# EAGLE board driver (EAGLE 9.6.2)
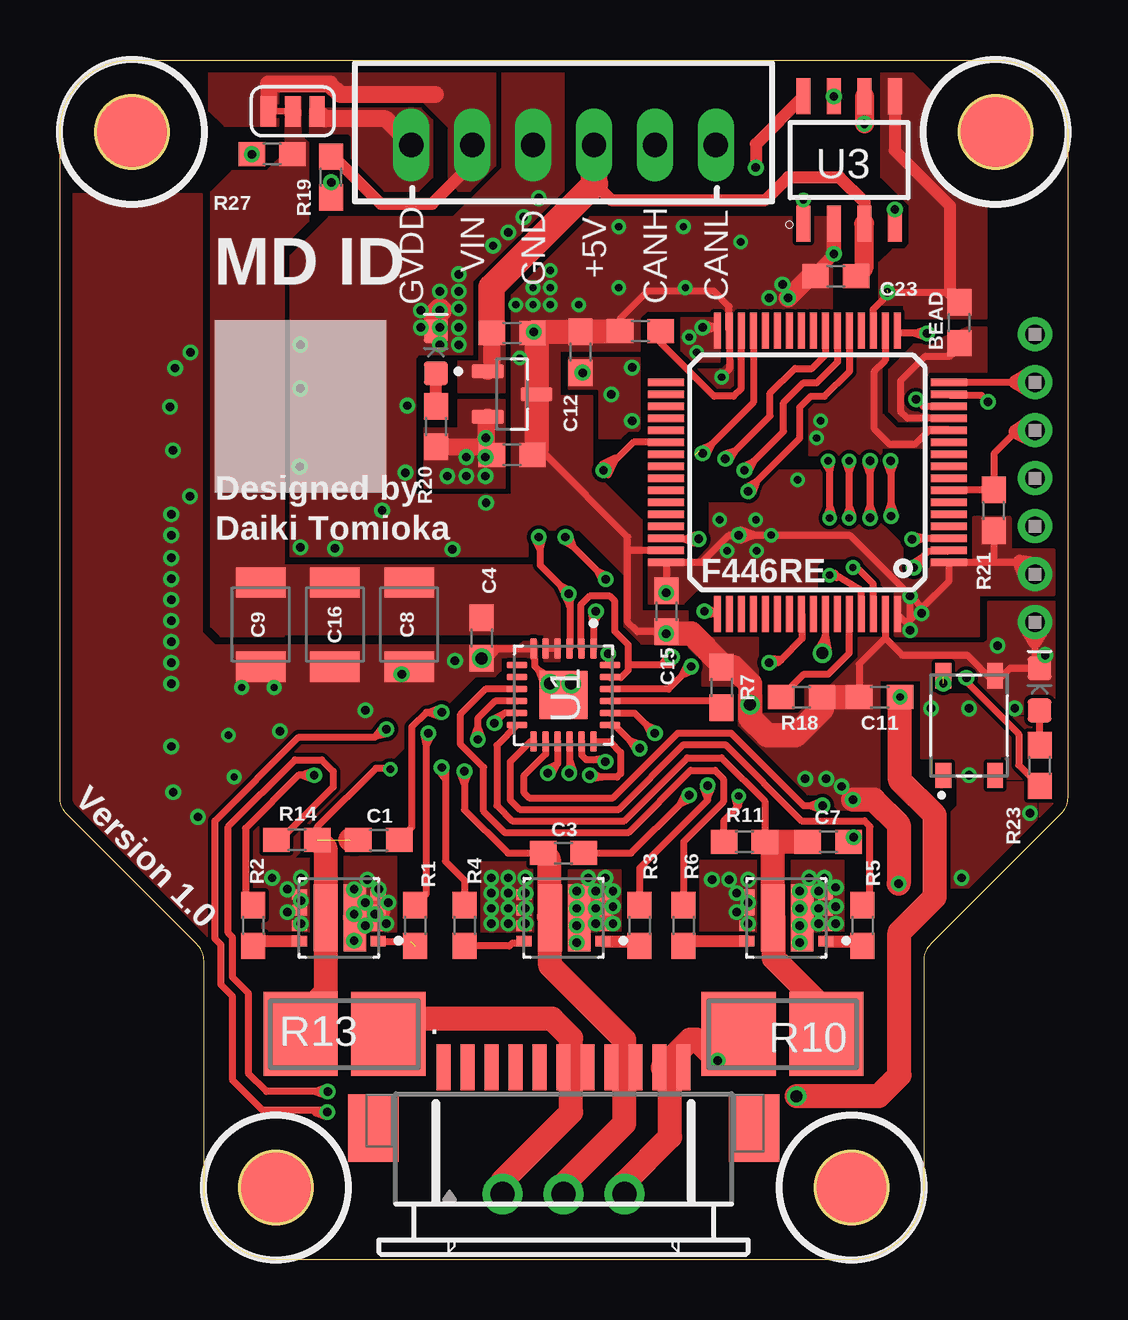
[diagram p1: board, top side]
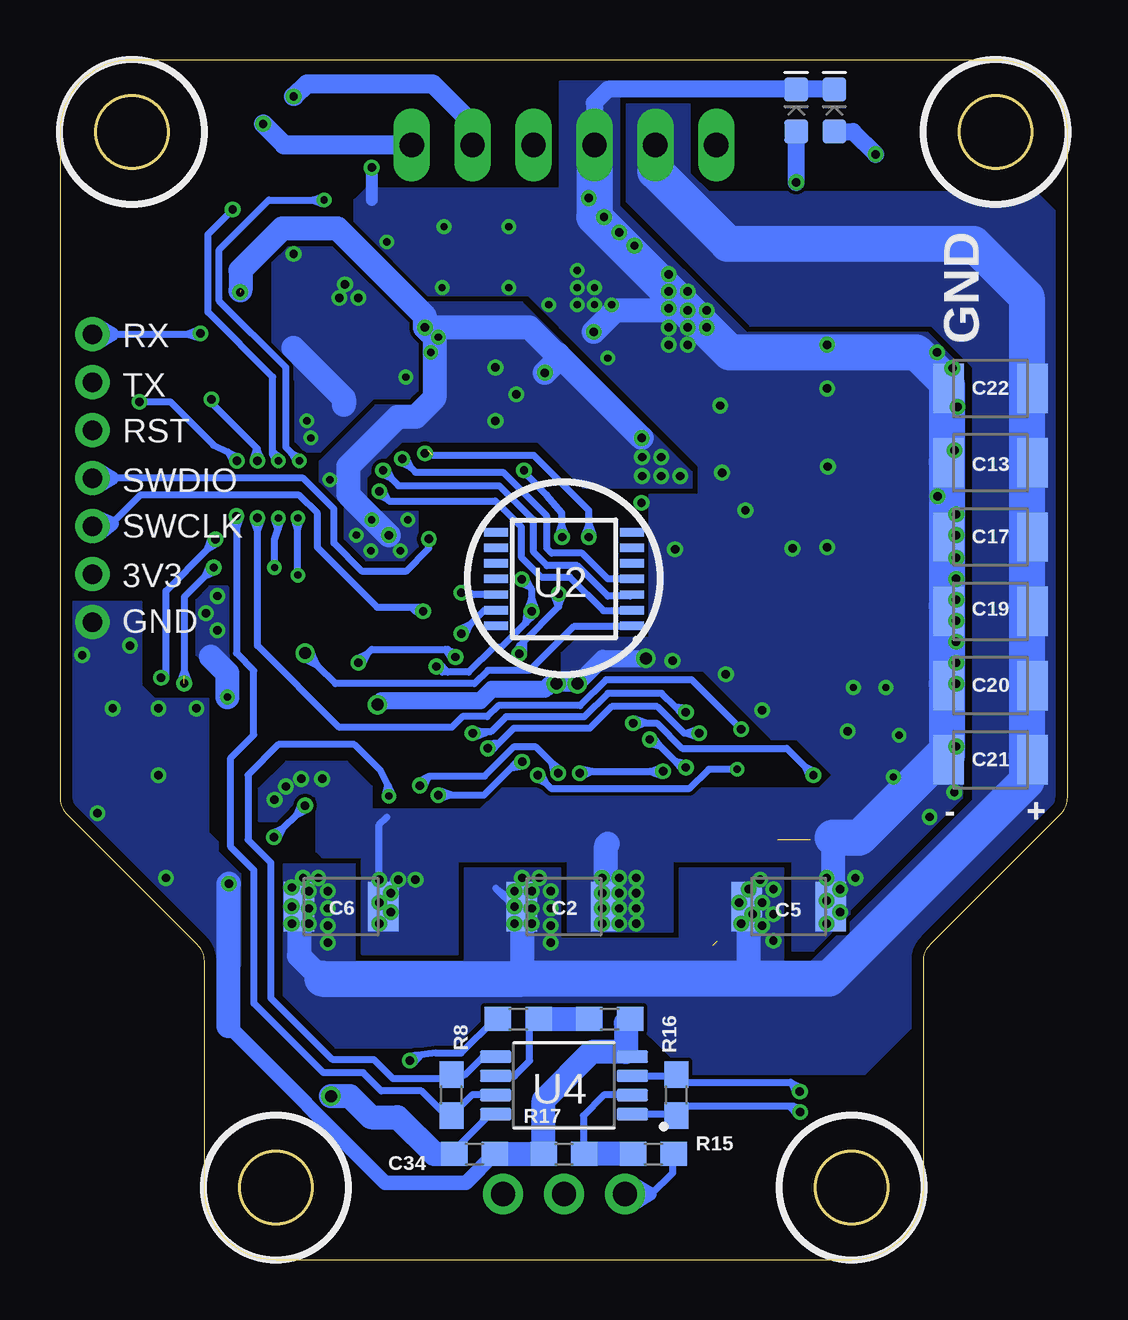
[diagram p2: board, bottom side, seen from below]

Size 42 x 50 mm. Coordinates in mm from the lower left corner, seen from the top.
Outline: 33,0 9,0 arc-90 6,3 6,12.44 arc45 5.71,13.15 0.29,18.56 arc-45 0,19.27 0,47 arc-90 3,50 39,50 arc-90 42,47 42,19.27 arc-45 41.71,18.56 36.29,13.15 arc45 36,12.44 36,3 arc-90 33,0
Outline: circle at 3,47 radius 1.5
Outline: circle at 39,47 radius 1.5
Outline: circle at 9,3 radius 1.5
Outline: circle at 33,3 radius 1.5
Copper layers (1*16): Top 0.035mm / dielectric 1.6mm / Bottom 0.035mm
Design rules "Elecrow_2-layer_PCB_eagle_rule": minimum track width 6mil, minimum drill 12mil, track to track 6mil, track to pad 6mil, pad to pad 6mil, via to via 8mil, smd to smd 0mil, copper to edge 20mil, drill to drill 10mil, minimum pad ring 6mil, minimum via ring 6mil, stop-mask expansion 0mil, vias tented up to drill 100mil, thermal gap 10mil
Net classes: 0 default: width 0.3 mm
tRestrict: area 0,44 to 6,50; area 36,44 to 42,50; area 6,0 to 12,6; area 30,0 to 36,6; 9 lines
bRestrict: area 0,44 to 6,50; area 36,44 to 42,50

## Footprints (pad centres in the part's own frame; a part is rotated, then mirrored left to right if it is on the bottom)
CON-SMT-FFCFPC_52207-1185 = smd 0.6 x 1.9: 1 -5,2.5; 2 -4,2.5; 3 -3,2.5; 4 -2,2.5; 5 -1,2.5; 6 0,2.5; 7 1,2.5; 8 2,2.5; 9 3,2.5; 10 4,2.5; 11 5,2.5 | smd 2.1 x 2.8: P$1 -7.93,-0.03; P$4 7.945,-0.03
0603 = smd 1.1 x 1: 1 -0.85,0; 2 0.85,0
1210 = smd 1.27 x 2.06: 1 -1.755,0; 2 1.755,0
1608 = smd 1.1 x 1: 1 -0.85,0; 2 0.85,0
LED-0603 = smd 1 x 1: A -0.877,0; C 0.877,0
SMT-JUMPER_3_1-NC_TRACE_SILK = smd 0.635 x 1.27: 1 -1.016,0; 2 0,0; 3 1.016,0
1X03-CLEANBIG = drill 1.016 pad 1.676: 1 -2.54,0; 2 0,0; 3 2.54,0
STM32F446RET6 = smd 0.3 x 1.5: BOOT0 -1.75,5.9; PA3 -3.75,-5.9; PA4 -2.25,-5.9; PA5 -1.75,-5.9; PA6 -1.25,-5.9; PA7 -0.75,-5.9; PA14 3.75,5.9; PA15 3.25,5.9; PB0 0.75,-5.9; PB1 1.25,-5.9; PB2 1.75,-5.9; PB3 0.75,5.9; PB4 0.25,5.9; PB5 -0.25,5.9; PB6 -0.75,5.9; PB7 -1.25,5.9; PB8 -2.25,5.9; PB9 -2.75,5.9; PB10 2.25,-5.9; PC4 -0.25,-5.9; PC5 0.25,-5.9; PC10 2.75,5.9; PC11 2.25,5.9; PC12 1.75,5.9; PD2 1.25,5.9; VCAP_1 2.75,-5.9; VDD -2.75,-5.9; VDD1 3.75,-5.9; VDD3 -3.75,5.9; VSS -3.25,-5.9; VSS1 3.25,-5.9; VSS3 -3.25,5.9 | smd 1.5 x 0.3: NRST -5.9,0.75; PA0 -5.9,-2.75; PA1 -5.9,-3.25; PA2 -5.9,-3.75; PA8 5.9,0.25; PA9 5.9,0.75; PA10 5.9,1.25; PA11 5.9,1.75; PA12 5.9,2.25; PA13 5.9,2.75; PB12 5.9,-3.75; PB13 5.9,-3.25; PB14 5.9,-2.75; PB15 5.9,-2.25; PC0 -5.9,0.25; PC1 -5.9,-0.25; PC2 -5.9,-0.75; PC3 -5.9,-1.25; PC6 5.9,-1.75; PC7 5.9,-1.25; PC8 5.9,-0.75; PC9 5.9,-0.25; PC13 -5.9,3.25; PC14 -5.9,2.75; PC15 -5.9,2.25; PH0 -5.9,1.75; PH1 -5.9,1.25; VBAT -5.9,3.75; VDD2 5.9,3.75; VREF+ -5.9,-2.25; VREF- -5.9,-1.75; VSS2 5.9,3.25
TRANS_SIZ240DT-T1-GE3 = smd 0.62 x 0.44: 1 -1.64,0.975; 2 -1.64,0.325; 3 -1.64,-0.325; 4 -1.64,-0.975; 5 1.64,-0.975; 6 1.64,-0.325; 7 1.64,0.325; 8 1.64,0.975 | smd 1.005 x 2.8: 9 0.557,0 | smd 0.935 x 2.8: 10 -0.662,0
SMS-REF = smd 3.1 x 3.5: 1 1.829,0; 2 -1.829,0
R0603 = smd 1.1 x 1: 1 -0.85,0; 2 0.85,0
SOT95P237X112-3N = smd 1.32 x 0.59: 1 -1.015,0.95; 2 -1.015,-0.95; 3 1.015,0
SW_SKRPACE010 = smd 1.05 x 0.65: 1 -2.075,1.075; 2 2.075,1.075; 3 -2.075,-1.075; 4 2.075,-1.075
QFN50P400X400X100-25N = smd 0.27 x 0.86: BSTA 0.75,1.935; DT 0.25,1.935; GHA 1.25,1.935; GLA 0.75,-1.935; GLB 0.25,-1.935; GLC -0.25,-1.935; INHA -0.25,1.935; INHB -0.75,1.935; INHC -1.25,1.935; NC1 -1.25,-1.935; NC2 -0.75,-1.935; SHC 1.25,-1.935 | smd 0.86 x 0.27: BSTB 1.935,0.75; BSTC 1.935,-0.75; GHB 1.935,0.25; GHC 1.935,-1.25; GND -1.935,-1.25; GVDD -1.935,-0.25; INLA -1.935,1.25; INLB -1.935,0.75; INLC -1.935,0.25; MODE -1.935,-0.75; SHA 1.935,1.25; SHB 1.935,-0.25 | smd 2 x 2: PAD 0,0
SOP65P640X120-14N = smd 1 x 0.35: 1 -2.825,1.95; 2 -2.825,1.3; 3 -2.825,0.65; 4 -2.825,0; 5 -2.825,-0.65; 6 -2.825,-1.3; 7 -2.825,-1.95; 8 2.825,-1.95; 9 2.825,-1.3; 10 2.825,-0.65; 11 2.825,0; 12 2.825,0.65; 13 2.825,1.3; 14 2.825,1.95
SOIC127P600X175-8N = smd 1.5 x 0.6: 1 -2.65,1.905; 2 -2.65,0.635; 3 -2.65,-0.635; 4 -2.65,-1.905; 5 2.65,-1.905; 6 2.65,-0.635; 7 2.65,0.635; 8 2.65,1.905
SOP80P620X125-8N = smd 1.31 x 0.52: 1 -2.85,1.2; 2 -2.85,0.4; 3 -2.85,-0.4; 4 -2.85,-1.2; 5 2.85,-1.2; 6 2.85,-0.4; 7 2.85,0.4; 8 2.85,1.2
3MM = smd 3 x 3: P$1 0,0
1X7 = drill 0.8 pad 1.422: 1 -6,0; 2 -4,0; 3 -2,0; 4 0,0; 5 2,0; 6 4,0; 7 6,0
JST-XH-06-PACKAGE-LONG-PAD = drill 1.016 long: 1 -6.35,0; 2 -3.81,0; 3 -1.27,0; 4 1.27,0; 5 3.81,0; 6 6.35,0

## Placement (x,y rotation side)
.  FFC12_11PIN_1MM  [CON-SMT-FFCFPC_52207-1185]  20.99,5.51 0 top
BEAD  0  [0603]  37.49,39.05 90 top
C1  0.1uF  [0603]  13.29,17.49 180 top
C2  22UF-1210  [1210]  20.99,14.72 180 bottom
C3  0.1uF  [0603]  20.99,16.94 180 top
C4  0.1uF  [0603]  17.58,25.91 270 top
C5  22UF-1210  [1210]  11.62,14.72 180 bottom
C6  22UF-1210  [1210]  30.28,14.72 180 bottom
C7  0.1uF  [0603]  32.02,17.41 180 top
C8  22UF-1210  [1210]  14.56,26.46 90 top
C9  22UF-1210  [1210]  8.37,26.46 90 top
C10  0.1UF  [1608]  18.85,33.53 0 top
C11  0.1uF  [0603]  34.17,23.45 180 top
C12  0.1uF  [0603]  21.7,37.81 90 top
C13  22UF-1210  [1210]  3.21,33.21 0 bottom
C14  4.7uF  [0603]  24.2,38.7 180 top
C15  0.1uF  [0603]  25.28,27.02 270 top
C16  22UF-1210  [1210]  11.46,26.46 90 top
C17  22UF-1210  [1210]  3.21,30.11 0 bottom
C18  0.1UF  [1608]  18.85,38.61 0 top
C19  22UF-1210  [1210]  3.21,27.02 0 bottom
C20  22UF-1210  [1210]  3.21,23.92 0 bottom
C21  22UF-1210  [1210]  3.21,20.83 0 bottom
C22  22UF-1210  [1210]  3.21,36.31 0 bottom
C23  0.1uF  [0603]  32.34,40.99 180 top
C34  0.1uF  [0603]  24.72,4.4 0 bottom
D1  WHITE  [LED-0603]  11.31,47.9 90 bottom
D2  RED  [LED-0603]  9.72,47.9 90 bottom
D3  WHITE  [LED-0603]  15.67,37.81 90 top
D6  WHITE  [LED-0603]  40.83,23.77 90 top
JP2  JUMPER-SMT_3_1-NC_TRACE_SILK  [SMT-JUMPER_3_1-NC_TRACE_SILK]  9.71,47.86 180 top
JP3  [1X03-CLEANBIG]  20.99,2.73 0 top
NUCLEO_MAIN  F446RET6  [STM32F446RET6]  31.15,32.81 180 top
Q2  SIZ240DT-T1-GE3  [TRANS_SIZ240DT-T1-GE3]  11.62,14.24 180 top
Q3  SIZ240DT-T1-GE3  [TRANS_SIZ240DT-T1-GE3]  20.99,14.24 180 top
Q4  SIZ240DT-T1-GE3  [TRANS_SIZ240DT-T1-GE3]  30.28,14.24 180 top
R1  50  [0603]  14.8,13.92 270 top
R2  50  [0603]  8.05,13.92 270 top
R3  50  [0603]  24.16,13.92 270 top
R4  50  [0603]  16.86,13.92 270 top
R5  50  [0603]  33.45,13.92 270 top
R6  50  [0603]  25.99,13.92 270 top
R7  50k  [0603]  27.58,23.84 270 top
R8  33k  [0603]  25.67,6.86 90 bottom
R9  33k  [0603]  19.08,10.03 180 bottom
R10  [SMS-REF]  30.12,9.4 180 top
R11  1k  [0603]  28.53,17.41 0 top
R12  1k  [0603]  22.89,10.03 180 bottom
R13  [SMS-REF]  11.86,9.4 0 top
R14  1k  [0603]  9.88,17.49 0 top
R15  1k  [0603]  17.26,4.4 0 bottom
R16  33k  [0603]  16.31,6.86 90 bottom
R17  33k  [0603]  20.99,4.4 0 bottom
R18  10k  [R0603]  30.91,23.45 180 top
R19  10k  [0603]  11.31,45.12 90 top
R20  1k  [R0603]  15.67,34.72 270 top
R21  10k  [R0603]  38.93,31.23 90 top
R23  1k  [0603]  40.83,20.59 270 top
R27  8k  [0603]  8.85,46.07 0 top
REG  AP7333  [SOT95P237X112-3N]  18.85,36.07 0 top
S1  SKRPACE010  [SW_SKRPACE010]  37.9,22.26 90 top
U1  QFN50P400X400X100-25NDRV8300DRGER  [QFN50P400X400X100-25N]  20.99,23.53 270 top
U2  AS5048A-HTSP-500  [SOP65P640X120-14N]  20.99,28.37 180 bottom
U3  MCP2562-E/SN  [SOIC127P600X175-8N]  32.9,45.83 90 top
U4  SOP80P620X125-8N  [SOP80P620X125-8N]  20.99,7.26 180 bottom
U$1  PIN  [3MM]  39,47 0 top
U$2  1X7  [1X7]  40.64,32.57 90 top
U$3  PIN  [3MM]  3,47 0 top
U$4  PIN  [3MM]  9,3 0 top
U$5  PIN  [3MM]  33,3 0 top
X2  JST-XH-06-PIN-LONG-PAD  [JST-XH-06-PACKAGE-LONG-PAD]  20.99,46.47 0 top

## Tracks (layer width: path | path; a pad name or v marks a point on that pad's centre or on a via)
3V3  (via drill 0.3, 0.35, 0.5)  (1 unrouted)
  Top 0.3: 38.93,29.06 NUCLEO_MAIN.VBAT 37.05,28.27 35.93,27.16 | 38.93,29.06 40.02,29.06 40.15,29.06 U$2.2 | R21.1 38.93,29.06 | NUCLEO_MAIN.VDD1 27.4,38.85 27.31,38.85 | 27.31,38.85 v26.78,38.85 | 25.28,28.32 25.28,29.04 NUCLEO_MAIN.VDD2 26.76,29.06 27.9,30.19 27.93,30.19 | 25.28,28.32 C15.1 | 35.4,26.62 35.93,27.16 | v28.29,30.19 28.98,30.19 | 28.98,30.19 v29.64,30.19 32.92,30.19 35.55,27.57 35.93,27.18 35.93,27.16 | 34.9,26.83 NUCLEO_MAIN.VDD3 35.2,26.62 35.4,26.62 | 27.93,30.19 v28.29,30.19 | 21.9,37 C12.1 | 27.31,38.85 26.84,39.01 v26.78,38.85 | 27.31,38.85 26.84,38.68 v26.78,38.85 | 21.83,36.9 21.78,36.91 v21.78,36.96 21.7,36.88 21.7,36.65 21.7,36.64 | 25.28,28.32 25.11,27.85 v25.28,27.79 25.44,27.85 25.28,28.32 | 28.98,30.19 28.37,30.41 v28.29,30.19 | 28.98,30.19 28.37,29.98 v28.29,30.19 | 27.93,30.19 28.25,30.08 v28.29,30.19 | 27.93,30.19 28.25,30.31 v28.29,30.19 | v35.44,27.65 35.44,26.62 35.4,26.62 | NUCLEO_MAIN.VDD 33.9,39.61 34.61,40.32 37.07,40.32
  Top 0.5: U3.5 34.8,46.23 37.1,43.93 37.1,40.29 | 37.07,40.32 37.1,40.29 | 37.1,40.29 BEAD.2
  Top 0.6: 40.02,29.06 40.26,28.42 U$2.2 40.7,28.97 40.02,29.06
  Top 0.7: REG.2 17.75,35.04 v17.75,34.24 17.75,33.77 C10.1 17.66,33.87 R20.2
  Top 1: v30.7,6.81 34.12,6.81 34.99,7.68 34.99,13.64 36.47,15.11 36.47,18.53 35.02,19.98 C11.1
  Bottom 0.3: U4.8 24.07,6.05 25.57,4.56 C34.1 | v26.78,38.85 26.76,38.87 | U2.12 24.76,27.72 | 24.76,27.72 25.2,27.72 v25.28,27.79 | 22.15,37 v21.78,36.96 | v21.78,36.96 21.83,37.13 | v21.78,36.96 21.85,36.8 | 24.76,27.72 25.24,27.62 v25.28,27.79 | 24.76,27.72 25.19,27.95 v25.28,27.79
  Bottom 1: C34.1 26.39,4.4 27.93,5.94 29.04,5.94 29.91,6.81 v30.7,6.81 | v17.75,34.24 21.24,37.73 21.24,37.65 | 21.24,37.65 22.44,38.85 v26.78,38.85 | v26.78,38.85 26.78,39.32 30.44,42.97 32.74,42.97 34.48,41.24 34.48,40.4 | v26.78,38.85 26.39,38.45 26.39,35.91 27.17,35.12 27.92,35.12 29.99,33.06 29.99,31.89 v28.29,30.19 | v21.78,36.96 21.24,37.51 21.24,37.65 | C11.1 35.02,24.43 35.7,25.12
  other vias: 35.02,23.45 35.44,26.23 35.91,26.94 26.23,38.45 26.55,37.81 27.5,30.83 29.01,30.83 17.74,33.45 17.74,32.66 16.94,32.66 16.15,32.66 16.94,33.45 27.82,29.54 29.04,29.54 30.75,32.5 23.85,34.96 23.85,37.18 22.97,36.07 34.49,40.32
  pour Top (no thermals): 34.8,27.65 35.12,27.65 36.15,28.69 36.31,28.84 36.31,29.16 38.29,29.16 38.29,25.99 34.8,25.99
  pour Bottom (no thermals): 35.04,28.05 35.75,28.05 36.31,27.5 36.31,25.27 36.31,25.19 35.59,24.48 35.04,24.48 34.96,24.56 34.96,27.97
  pour Top (no thermals): 25.91,39.24 27.5,39.24 27.5,37.42 26.39,37.42 25.91,37.89
  pour Top (no thermals): 24.56,29.16 24.56,27.34 25.99,27.34 26.7,28.05 31.55,28.05 31.55,28.92 31.86,29.24 33.21,29.24 34.25,28.21 34.25,28.13 34.4,27.97 34.72,27.97 34.8,27.89 34.8,27.1 36.23,27.1 36.23,28.37 35.36,28.37 35.12,28.61 35.12,29.8 32.02,32.89 27.1,32.89 27.1,29.72 26.55,29.16
  pour Bottom (no thermals): 15.67,32.81 15.67,32.18 20.2,32.18 22.1,34.08 27.74,34.08 29.24,32.58 29.24,31.78 28.61,31.15 27.1,31.15 27.1,29.72 27.66,29.16 29.24,29.16 30.12,30.04 30.12,31.38 31.15,32.42 31.15,33.29 28.85,35.59 27.02,35.59 26.78,35.83 26.78,39.88 22.74,39.88
  pour Top (no thermals): 16.62,35.83 18.53,35.83 18.53,32.18 15.2,32.18 15.2,34.64 16.62,34.64
  pour Top (no thermals): 41.39,29.56 41.39,27.73 38.13,27.73 38.13,30.91 39.56,30.91 39.56,29.56
  pour Top (no thermals): 24.16,37.58 21.23,37.58 21.23,36.31 22.42,36.31 22.5,36.23 22.5,34.24 23.37,34.24 23.69,34.56 24.09,34.56 24.16,34.64
  pour Top (no thermals): 35.52,49.48 34.25,49.48 34.25,45.12 35.44,43.93 35.44,42.34 35.2,42.1 34.72,42.1 34.17,41.55 34.17,39.8 35.2,39.8 35.2,39.24 38.61,39.24 38.61,46.39
5V
  Top 0.5: 22.26,44.88 22.3,44.84 22.97,44.16 29.4,44.16 30.36,45.12 32.5,45.12 33.53,44.09 U3.3
  Top 0.7: C18.1 18,37.18 REG.1
  Top 0.8: C23.1 33.51,41.31 33.51,43.16 U3.3
  Top 1.1: C18.1 18,40.54 22.3,44.84 | 22.26,44.88 X2.4
  pour Top (no thermals): 17.5,38.29 18.53,38.29 18.53,36.15 16.62,36.15 16.62,37.42 17.5,37.42
BOOT0
  Top 0.3: R18.2 31.01,24.4 32.02,24.4 32.9,25.28 NUCLEO_MAIN.BOOT0
BSTA  (via drill 0.35)
  Top 0.3: U1.BSTA 23.96,22.78 24.43,22.3 | v24.8,21.93 24.43,22.3 | v15.91,22.81 15.38,22.81 | 15.38,22.81 15.28,22.81 14.66,22.2 14.66,18.02 C1.1 | 24.43,22.3 24.64,21.86 v24.8,21.93 | 24.43,22.3 24.88,22.09 v24.8,21.93 | 15.38,22.81 15.85,22.65 v15.91,22.81 | 15.38,22.81 15.85,22.98 v15.91,22.81
  Bottom 0.3: v15.91,22.81 16.13,22.81 16.38,23.06 | 16.38,23.06 16.92,23.6 19.16,23.6 20.15,22.62 23.41,22.62 24.01,22.02 24.5,22.02 | 24.27,21.94 24.64,21.94 24.64,21.93 v24.8,21.93 | 24.27,21.94 24.74,21.77 v24.8,21.93 | 24.27,21.94 24.5,22.02 | 24.5,22.02 24.74,22.1 v24.8,21.93 | 16.38,23.06 15.88,22.99 v15.91,22.81 | 16.38,23.06 16.04,22.69 v15.91,22.81
BSTB  (via drill 0.35)
  Top 0.3: U1.BSTB 21.74,21.03 21.94,20.83 22.22,20.83 | v22.74,20.75 22.66,20.83 22.22,20.83 | C3.1 23.81,16.94 25.86,18.99 | v26.23,19.36 25.86,18.99 | 22.38,20.86 22.7,20.69 v22.74,20.75 | 22.22,20.83 22.38,20.86 | 22.38,20.86 22.7,20.92 v22.74,20.75 | 25.86,18.99 26.3,19.2 v26.23,19.36 | 25.86,18.99 26.07,19.43 v26.23,19.36
  Bottom 0.3: v22.74,20.75 22.93,20.75 23.19,20.49 | v26.23,19.36 25.7,19.36 | 25.7,19.36 24.32,19.36 23.19,20.49 | 23.19,20.49 22.87,20.86 v22.74,20.75 | 23.19,20.49 22.71,20.57 v22.74,20.75 | 25.7,19.36 26.17,19.19 v26.23,19.36 | 25.7,19.36 26.17,19.53 v26.23,19.36
BSTC  (via drill 0.35)
  Top 0.3: U1.BSTC 20.24,21.07 19.32,20.15 19.32,19.48 19.56,19.24 23.05,19.24 25.75,21.94 27.97,21.94 30.99,18.92 31.26,18.92 | 31.26,18.92 v31.78,18.92 | C7.1 32.9,17.48 v33.08,17.61 | 31.26,18.92 31.73,18.76 v31.78,18.92 | 31.26,18.92 31.73,19.09 v31.78,18.92
  Bottom 0.3: 32.14,18.54 31.88,18.8 31.88,18.82 v31.78,18.92 | 32.14,18.54 32.71,17.98 | 32.71,17.98 v33.08,17.61 | 32.14,18.54 31.95,18.99 v31.78,18.92 | 32.14,18.54 31.7,18.77 v31.78,18.92 | 32.71,17.98 32.92,17.53 v33.08,17.61 | 32.71,17.98 33.16,17.77 v33.08,17.61
C_U  (via drill 0.35)
  Top 0.3: v11.15,6.14 10.62,6.14 | 10.84,6.22 8.45,6.22 7.18,7.49 7.18,10.99 6.7,11.46 6.7,13.13 6.46,13.37 6.46,18.29 9.96,21.78 13.12,21.78 13.17,21.82 | v33.77,33.29 33.77,32.77 | 33.77,32.77 33.77,31.43 | 33.77,31.43 v33.77,30.91 | v13.61,22.11 13.45,22.11 13.17,21.82 | 10.62,6.14 11.09,5.98 v11.15,6.14 | 10.62,6.14 10.84,6.22 | 10.84,6.22 11.09,6.31 v11.15,6.14 | 13.17,21.82 13.65,21.93 v13.61,22.11 | 13.17,21.82 13.47,22.21 v13.61,22.11 | 33.77,31.43 33.6,30.97 v33.77,30.91 | 33.77,31.43 33.94,30.97 v33.77,30.91 | 33.77,32.77 33.94,33.23 v33.77,33.29 | 33.77,32.77 33.6,33.23 v33.77,33.29 | v35.68,35.85 35.7,35.85 35.98,35.56 NUCLEO_MAIN.PA0
  Bottom 0.3: U4.1 16.35,6.05 R16.1 15.91,6.41 11.6,6.41 | 11.6,6.41 11.41,6.41 v11.15,6.14 | v13.61,22.11 15.67,24.16 19.24,24.16 20.31,23.09 23.73,23.09 24.19,22.63 25.22,22.63 25.67,22.18 30.36,22.18 33.77,25.59 33.77,30.38 | 33.77,30.38 v33.77,30.91 | v33.77,33.29 33.77,33.79 33.8,33.81 | 11.6,6.41 11.12,6.32 v11.15,6.14 | 11.6,6.41 11.28,6.03 v11.15,6.14 | 33.77,30.38 33.94,30.85 v33.77,30.91 | 33.77,30.38 33.6,30.85 v33.77,30.91 | 33.8,33.81 33.61,33.36 v33.77,33.29 | 33.8,33.81 33.94,33.34 v33.77,33.29 | v35.68,35.85 35.68,35.7 33.8,33.81
C_W  (via drill 0.35)
  Top 0.3: v34.64,30.99 34.63,31 34.63,31.51 | v34.63,33.29 34.63,32.77 | 34.63,32.77 34.63,31.51 | 34.63,32.77 34.79,33.23 v34.63,33.29 | 34.63,32.77 34.46,33.23 v34.63,33.29 | 34.63,31.51 34.47,31.04 v34.64,30.99 | 34.63,31.51 34.81,31.05 v34.64,30.99 | NUCLEO_MAIN.PA1 37.1,36.02 38.42,36.02 v38.69,35.75
  Bottom 0.3: U4.7 24.83,6.86 R8.1 25.91,6.01 26.93,7.03 28.61,7.03 29.36,7.78 31.02,7.78 33.91,10.67 33.91,16.22 34.88,17.2 34.88,20.91 33.92,21.87 33.92,24.55 34.64,25.27 34.64,30.46 | 35,33.66 v34.63,33.29 | v34.64,30.99 34.64,30.46 | 35,33.66 35.6,33.95 37.41,35.75 v38.69,35.75 | 35,33.66 34.55,33.45 v34.63,33.29 | 35,33.66 34.79,33.21 v34.63,33.29 | 34.64,30.46 34.81,30.93 v34.64,30.99 | 34.64,30.46 34.48,30.93 v34.64,30.99
CANH  (via drill 0.35)
  Bottom 0.8: U3.7 32.23,48.48 31.71,49.01 26.47,49.01 24.8,47.34 X2.5
  other vias: 32.26,48.48
CANL  (via drill 0.35)
  Top 0.8: U3.6 v33.53,47.34
  Bottom 0.8: v33.53,47.34 32.66,46.47 X2.6
CANRX  (via drill 0.3, 0.35)
  Top 0.3: NUCLEO_MAIN.PB9 33.9,28.16 33.21,28.84 v33.05,28.84 | v32.9,30.91 32.9,31.37 | 32.9,31.37 32.9,32.83 | 32.9,32.83 v32.9,33.29 | 32.9,31.37 32.75,30.96 v32.9,30.91 | 32.9,31.37 33.04,30.96 v32.9,30.91 | 32.9,32.83 33.04,33.24 v32.9,33.29 | 32.9,32.83 32.75,33.24 v32.9,33.29 | v34.8,43.77 U3.4
  Bottom 0.3: v33.05,28.84 33.05,30.01 32.9,30.45 | 32.9,30.45 v32.9,30.91 | v32.9,33.29 33.13,33.53 33.13,33.68 | 33.13,33.68 33.13,36.78 35.83,39.48 35.83,42.74 v34.8,43.77 | 32.9,30.45 33.04,30.86 v32.9,30.91 | 32.9,30.45 32.75,30.86 v32.9,30.91 | 33.13,33.68 32.8,33.41 v32.9,33.29 | 33.13,33.68 33.05,33.26 v32.9,33.29
CANTX  (via drill 0.3)
  Top 0.3: NUCLEO_MAIN.PB8 33.4,27.86 33.31,27.96 32.34,28.53 32.18,28.53 | v32.08,28.53 32.26,28.53 32.38,28.41 | v32.08,30.91 32.08,31.37 | 32.08,31.37 32.08,32.84 | 32.08,32.84 32.08,33.23 v32.02,33.29 | v30.99,44.16 30.99,43.71 | 30.99,43.71 U3.1 | 32.38,28.41 32.3,28.61 v32.08,28.53 | 32.38,28.41 32.18,28.53 | 32.18,28.53 32.11,28.57 v32.08,28.53 | 32.08,31.37 31.94,30.96 v32.08,30.91 | 32.08,31.37 32.23,30.96 v32.08,30.91 | 32.08,32.84 32.17,33.26 v32.02,33.29 | 32.08,32.84 31.89,33.22 v32.02,33.29 | 30.99,43.71 31.14,44.11 v30.99,44.16 | 30.99,43.71 30.85,44.11 v30.99,44.16
  Bottom 0.3: v32.08,28.53 32.08,30.45 | 32.08,30.45 v32.08,30.91 | v32.02,33.29 32.35,33.61 | 32.35,33.61 32.58,33.85 32.58,37.18 35.36,39.96 35.36,42.1 33.29,44.16 31.45,44.16 | 31.45,44.16 v30.99,44.16 | 32.08,30.45 32.23,30.86 v32.08,30.91 | 32.08,30.45 31.94,30.86 v32.08,30.91 | 32.35,33.61 31.96,33.43 v32.02,33.29 | 32.35,33.61 32.16,33.22 v32.02,33.29 | 31.45,44.16 31.04,44.31 v30.99,44.16 | 31.45,44.16 31.04,44.02 v30.99,44.16
CLK  (via drill 0.35)
  Top 0.3: v28.69,32.02 28.69,32.08 29.03,32.42 | 29.03,32.42 30.84,34.23 30.84,35.52 31.3,35.98 31.87,35.98 32.9,37.01 NUCLEO_MAIN.PA5 | 29.03,32.42 28.6,32.17 v28.69,32.02 | 29.03,32.42 28.86,31.96 v28.69,32.02
  Bottom 0.3: U2.2 18.19,27.04 19.35,27.04 20.76,28.45 21.94,28.45 22.78,29.28 22.78,30.55 23.85,31.62 28.29,31.62 28.32,31.65 | v28.69,32.02 28.32,31.65 | 28.32,31.65 28.76,31.86 v28.69,32.02 | 28.32,31.65 28.53,32.1 v28.69,32.02
CS  (via drill 0.5)
  Top 0.3: NUCLEO_MAIN.PB6 31.9,26.01 | 31.9,26.01 31.9,25.39 v31.78,25.27 | 31.9,26.01 31.56,25.39 v31.78,25.27 | 31.9,26.01 32.03,25.32 v31.78,25.27
  Bottom 0.3: U2.1 18.2,26.38 20.59,26.38 22.42,24.56 24.16,24.56 24.72,24 30.51,24 31.25,24.74 | 31.25,24.74 v31.78,25.27 | 31.25,24.74 31.89,25.05 v31.78,25.27 | 31.25,24.74 31.56,25.38 v31.78,25.27
DT
  Top 0.3: R7.2 27.3,23.28 U1.DT
GHA  (via drill 0.35)
  Top 0.3: R1.1 15.28,15.25 15.28,21.42 | v15.35,21.94 15.28,21.86 15.28,21.42 | v24.16,21.3 24.09,21.3 23.76,21.63 | 23.76,21.63 23.11,22.28 U1.GHA | 15.28,21.42 15.51,21.86 v15.35,21.94 | 15.28,21.42 15.18,21.91 v15.35,21.94 | 23.76,21.63 24.01,21.21 v24.16,21.3 | 23.76,21.63 24.22,21.47 v24.16,21.3
  Bottom 0.3: v24.16,21.3 23.93,21.3 23.69,21.54 | 23.69,21.54 23.09,22.14 19.92,22.14 19.01,23.05 17.1,23.05 15.99,21.94 15.88,21.94 | 15.88,21.94 v15.35,21.94 | 15.88,21.94 15.41,22.11 v15.35,21.94 | 15.88,21.94 15.41,21.77 v15.35,21.94 | 23.69,21.54 24.04,21.18 v24.16,21.3 | 23.69,21.54 24.18,21.48 v24.16,21.3
GHB  (via drill 0.35)
  Top 0.3: U1.GHB 21.24,20.8 | 21.24,20.8 21.24,20.28 v21.23,20.27 | v27,19.76 27,19.23 | 27,19.23 27,19.14 24.16,16.31 R3.1 | 21.28,20.69 21.13,20.31 v21.23,20.27 | 21.24,20.8 21.28,20.69 | 21.28,20.69 21.4,20.33 v21.23,20.27 | 27,19.23 27.17,19.7 v27,19.76 | 27,19.23 26.83,19.7 v27,19.76
  Bottom 0.3: v21.23,20.27 21.23,20.43 21.51,20.71 | 21.51,20.71 22.18,21.38 23.07,21.38 24.3,20.15 26.6,20.15 26.63,20.13 | v27,19.76 26.63,20.13 | 21.51,20.71 21.12,20.41 v21.23,20.27 | 21.51,20.71 21.4,20.23 v21.23,20.27 | 26.63,20.13 26.84,19.68 v27,19.76 | 26.63,20.13 27.08,19.92 v27,19.76
GHC
  Top 0.3: U1.GHC 19.61,21.59 18.77,20.75 18.77,19.16 19.16,18.76 23.29,18.76 25.99,21.46 27.74,21.46 30.91,18.29 33.53,18.29 33.77,18.05 33.77,14.77 R5.1
GLA  (via drill 0.35)
  Top 0.3: U1.GLA 18.53,22.78 18.48,22.73 | 18.48,22.73 v18.11,22.36 | v10.59,20.19 10.07,20.19 | 10.07,20.19 9.96,20.19 7.73,17.97 7.73,15.09 R2.1 | 18.48,22.73 18.33,22.66 | 18.33,22.66 18.04,22.52 v18.11,22.36 | 18.33,22.66 18.17,22.33 v18.11,22.36 | 10.07,20.19 10.53,20.03 v10.59,20.19 | 10.07,20.19 10.53,20.36 v10.59,20.19
  Bottom 0.3: v18.11,22.36 17.58,22.36 | 17.58,22.36 17.12,22.36 16.07,21.3 11.7,21.3 10.96,20.56 | v10.59,20.19 10.96,20.56 | 17.58,22.36 18.05,22.19 v18.11,22.36 | 17.58,22.36 18.05,22.52 v18.11,22.36 | 10.96,20.56 10.52,20.35 v10.59,20.19 | 10.96,20.56 10.75,20.12 v10.59,20.19
GLB  (via drill 0.35)
  Top 0.3: U1.GLB 18.14,23.28 17.41,22.55 17.41,22.2 | 17.41,22.2 v17.41,21.68 | v15.91,20.51 16.07,20.35 16.07,20.01 | 16.07,20.01 16.07,16.6 16.86,15.81 R4.1 | 17.41,22.2 17.25,21.74 v17.41,21.68 | 17.41,22.2 17.58,21.74 v17.41,21.68 | 16.07,20.01 16.09,20.5 v15.91,20.51 | 16.07,20.01 15.77,20.4 v15.91,20.51
  Bottom 0.3: v15.91,20.51 16.09,20.51 16.36,20.78 | v17.41,21.68 17.25,21.68 16.97,21.39 | 16.97,21.39 16.36,20.78 | 16.97,21.39 17.45,21.51 v17.41,21.68 | 16.97,21.39 17.27,21.79 v17.41,21.68 | 16.36,20.78 15.88,20.68 v15.91,20.51 | 16.36,20.78 16.05,20.4 v15.91,20.51
GLC
  Top 0.3: U1.GLC 17.75,23.78 16.7,22.73 16.7,21.46 17.66,20.51 17.66,18.68 18.53,17.81 23.71,17.81 26.29,20.39 27.31,20.39 27.65,20.04 27.65,19.08 25.99,17.41 R6.1
GND  (via drill 0.3, 0.35, 0.5)
  Top 0.3: 19.95,24.57 19.79,24.73 19.79,25.02 19.74,25.07 U1.GND 18.21,25.46 | 19.95,24.57 20.56,23.96 | 20.56,23.96 U1.PAD 21.07,23.61 | C4.2 17.98,25.46 18.21,25.46 | NUCLEO_MAIN.VSS 34.4,37.47 33.96,37.03 33.96,34.61 34.59,33.98 35.63,33.98 36.25,34.6 37.02,34.6 NUCLEO_MAIN.VREF- | U$2.1 40.64,25.77 40.64,24.83 D6.C 39.6,24.64 38.98,24.03 38.83,24.19 | 38.83,24.19 S1.4 | NUCLEO_MAIN.VSS3 34.4,25.91 | 34.4,25.91 34.4,25.9 33.32,24.82 C11.2 | 34.4,25.91 35.11,25.19 37.82,25.19 38.83,24.19 | v19.75,38.66 C18.2 | 19.86,36.15 REG.3 | C14.2 23.35,39.22 24.48,40.35 27.26,40.35 27.9,39.72 NUCLEO_MAIN.VSS1 27.9,37.1 v27.58,36.78 | C10.2 20.25,33.53 23.66,30.12 23.66,29.56 | 23.66,29.56 NUCLEO_MAIN.VSS2 | C15.2 24.76,26.17 | 24.76,26.17 24.06,26.17 23.66,26.57 23.66,29.56 | 21.07,23.61 21.31,23.84 v21.31,24 | U3.2 32.4,43.25 32.26,43.25 | 24.76,26.17 25.19,25.93 v25.28,26.09 25.24,26.26 24.76,26.17 | 20.56,23.96 21.24,23.76 v21.31,24 | 20.56,23.96 21.21,24.23 v21.31,24 | 19.95,24.57 20.2,23.91 v20.43,24 | 19.95,24.57 20.56,24.22 v20.43,24 | 21.07,23.61 20.63,24.16 v20.43,24 | 21.07,23.61 20.38,23.76 v20.43,24 | 18.21,25.46 17.52,25.3 C4.2 | 18.21,25.46 17.78,24.9 C4.2
  Top 0.5: 32.26,43.25 U3.2 | U3.8 29.01,46.5 v29.01,45.51 | v32.26,41.91 31.49,41.14 C23.2
  Top 0.6: v32.26,41.91 32.26,43.11 | 40.64,25.77 41,26.36 U$2.1 40.29,26.36 40.64,25.77
  Top 0.8: C23.2 31.26,40.99 v30.36,40.09
  Top 1: D3.C 15.67,39.4 v15.83,39.56 | v19.75,38.66 C12.2 21.74,38.7 C14.2 | C18.2 19.86,38.44 19.86,36.15 | REG.3 19.86,33.69 C10.2 | v34.96,15.67 34.96,18.13 33.93,19.16 v33.05,19.16 | C15.2 25.35,26.09 26.32,26.09 27.58,24.83 R7.1 28.08,24.69 28.77,24 v28.77,23.13 28.77,22.57 29.48,21.86 30.67,21.86 31.76,22.95 R18.1 C11.2
  Bottom 0.3: R9.1 18.23,8.55 U4.4 | U2.13 24.3,27.07 24.9,26.46 | 24.9,26.46 v25.28,26.09 | v9.48,15.43 9.64,15.55 9.69,15.35 | 9.69,15.35 9.79,15 | 9.79,15 9.82,14.88 | 9.82,14.88 C5.1 | v28.21,15.27 28.19,15.41 28.47,14.82 | 28.47,14.82 C6.1 | C21.1 4.9,21 5.04,20.91 | C20.1 4.9,24 4.99,24 | 4.99,24 5.04,24 | 4.95,27.07 4.9,27.25 5.04,27.25 | 4.95,27.07 C19.1 | C13.1 4.9,33.25 5.04,33.25 | C22.1 4.9,36.5 5.04,36.5 | 9.79,15 9.65,15.48 v9.48,15.43 | 9.79,15 9.38,15.28 v9.48,15.43 | 9.69,15.35 9.87,14.89 v10.04,14.95 10.12,15.11 9.69,15.35 | 9.82,14.88 9.39,14.63 v9.48,14.48 9.65,14.41 9.82,14.88 | 28.47,14.82 28.39,15.3 v28.21,15.27 | 28.47,14.82 28.1,15.14 v28.21,15.27 | 4.95,27.07 4.81,27.55 v4.64,27.5 4.54,27.35 4.95,27.07 | 24.9,26.46 25.12,26.01 v25.28,26.09 | 24.9,26.46 25.35,26.25 v25.28,26.09 | 4.99,24 5.45,23.84 5.51,24 5.45,24.17 4.99,24 | v27.9,15.83 28.07,15.87 28.2,15.4 27.79,15.68 v27.9,15.83 | v27.9,15.83 28.07,15.88 28.2,15.4 27.79,15.68 v27.9,15.83 | v28.69,15.83 28.69,18.13 28.37,18.45 | 28.29,15.21 28.54,14.79 v28.69,14.88 28.75,15.04 28.29,15.21 | 28.4,14.97 28.08,14.59 v28.21,14.48 28.39,14.47 28.4,14.97 | 4.96,27.04 4.54,26.77 v4.64,26.62 4.81,26.57 4.96,27.04
  Bottom 0.5: v29.01,45.51 29.01,44.16
  Bottom 0.6: 34.98,9.74 28.45,3.21 25.07,3.21 23.88,4.4 C34.2
  Bottom 0.7: D2.C D1.C 19.16,48.77 19.72,48.21 X2.3 | v28.77,23.13 28.61,23.29 24.48,23.29 24.01,23.77 21.78,23.77 21.55,24 v21.31,24 v20.43,24 19.38,25.06 C4.2
  Bottom 1: C34.2 R17.1 21.84,6.64 19.84,8.65 18.41,8.65 18.41,9.85 R9.1 | v15.83,39.56 18.86,39.56 v19.75,38.66 | v34.96,15.67 34.98,15.65 34.98,9.74 | C2.1 19.23,17.27 19.16,17.34 | 9.79,17.57 9.79,14.8 C5.1 | 30.16,35.63 30.16,35.89 32.26,38
  Bottom 1.5: X2.3 19.72,43.45 v15.83,39.56 14.08,37.81 6.31,37.81 5.04,36.54 5.04,36.5 5.04,33.25 5.04,27.25 5.04,24 5.04,21.23 | 5.04,21.23 5.04,20.91 | 5.04,21.23 8.69,17.57 9.79,17.57
  other vias: 10.04,14 28.69,14 18.69,15.27 19.4,14.64 18.69,14.64 19.4,14 4.58,35.54 4.64,29.24 4.64,28.37 17.58,25.06 31.71,34.96 4.64,25.75 4.64,24.88 4.64,31.07 4.64,24 4.64,30.19 8.85,15.91 10.04,15.91 17.97,15.91 18.69,15.91 19.4,15.27 27.18,15.83 17.97,15.27 17.97,14.64 17.97,14 18.69,14 19.4,15.91 20.43,39.8 19.72,39.8 19.01,39.8 20.43,40.51 19.72,40.51 20.43,41.23 19.16,37.58 30.12,40.64 29.56,40.09 31.55,34.24 8.93,23.84 7.58,23.84 7.26,20.11 31.07,20.03 31.94,20.03 32.58,19.72 15.83,40.35 16.62,40.35 16.62,39.64 16.62,38.85 15.83,38.85 15.04,39.56 15.04,38.85 16.62,41.07 18.05,42.26 18.69,42.81 19.32,43.45 19.96,44.24 15.83,38.13 16.62,38.13 23.29,43.05 25.99,43.05 28.37,42.42 26.07,40.51 23.29,40.51 21.62,39.8 10.02,38.13 9.99,33.05 10.02,29.69 11.46,29.64 13.43,31.23 14.4,32.8 14.48,35.59 10.02,36.31 12.74,22.89 14.24,24.4 16.47,24.96 16.36,29.61 17.76,31.54 4.8,37.16 5.43,37.81 4.72,19.48 4.64,21.38 5.75,18.45 9.16,22.02 7.02,21.86 41.07,25.19 39.8,22.97 36.31,22.97 37.9,22.97 37.9,20.19 40.44,18.61 37.58,15.91 39.09,25.59 4.71,33.73 5.41,31.82
  pour Top (no thermals): 8.45,16.7 10.43,16.7 10.43,13.68 8.45,13.68
  pour Top (no thermals): 17.58,16.54 19.8,16.54 19.8,13.68 17.58,13.68
  pour Top (no thermals): 26.7,16.62 29.09,16.62 29.09,13.68 26.7,13.68
  pour Top (no thermals): 19.32,25.75 19.88,25.75 19.88,25.11 18.37,25.11 18.37,24.56 18.13,24.32 17.34,24.32 5.75,12.73 -1.97,12.73 -1.97,44.4 5.91,44.4 5.91,26.15 6.46,25.59 19.16,25.59
  pour Bottom (no thermals): 18.69,49.09 18.69,43.93 13.37,38.61 5.83,38.61 4.4,37.18 4.4,19.24 10.59,13.05 10.59,19.4 9.32,20.67 9.32,27.02 21.15,38.85 21.15,49.09
  pour Bottom (no thermals): 9.08,17.57 9.08,14.4 10.59,12.89 11.46,12.89 11.46,17.57
  pour Bottom (no thermals): 16.47,17.1 16.47,13.68 20.83,13.68 20.83,17.1
  pour Bottom (no thermals): 25.43,18.13 25.43,12.73 29.4,12.73 29.4,18.13
  pour Bottom (no thermals): 8.61,19.64 23.61,19.64 24.48,18.76 29.4,18.76 29.4,16.62 8.61,16.62
  pour Top (no thermals): 18.85,30.75 18.85,40.2 22.1,43.45 32.1,43.45 32.18,43.37 32.18,39.56 24.48,39.56 24.16,39.24 24.16,37.89 20.83,37.89 20.83,35.99 22.18,35.99 22.18,32.89 24.24,30.83 24.24,27.02 26.15,27.02 26.15,25.67 24.24,25.67 23.53,26.38 23.53,28.53 21.62,30.43 19.16,30.43
  pour Bottom (no thermals): 27.1,38.69 27.1,36.23 27.42,35.91 28.93,35.91 31.15,33.69 31.78,33.69 32.18,34.08 32.18,36.62 33.13,37.58 33.13,41.55 32.5,42.18 30.59,42.18
  pour Top (no thermals): 34.25,37.73 33.13,37.73 31.23,35.83 31.23,33.53 34.25,33.53
  pour Top (no thermals): 27.97,37.5 28.05,37.5 28.05,36.39 27.66,35.99 26.55,37.1 27.58,37.1
  pour Top (no thermals): 33.29,25.91 34.48,25.91 34.72,25.67 38.53,25.67 38.69,25.83 38.69,27.42 41.71,27.42 41.71,15.51 35.91,15.51 35.91,24.16 34.17,24.16 34.17,18.76 32.42,18.76 31.78,19.4 31.15,19.4 28.29,22.26 28.29,23.53 29.24,23.53 29.24,22.73 30.75,22.73 31.07,23.05 31.07,23.84 32.02,23.84 33.29,25.11
  pour Top (no thermals): 26.23,25.91 29.09,25.91 29.09,23.92 26.78,23.92 26.78,24.96 26.23,25.51
  pour Top (no thermals): 18.45,49.48 20.99,49.48 20.99,44.56 17.18,40.75 17.18,37.73 14.96,37.73 14.8,37.58 14.8,32.5 11.62,29.32 9.62,29.32 9.62,41.84 11.23,43.45 16.39,43.45 18.45,45.51
  pour Bottom (no thermals): 20.59,44.64 29.24,44.64 29.72,44.16 29.72,43.21 26.7,40.2 22.5,40.2 20.91,38.61 20.59,38.61
  pour Top: 10.67,30.59 10.67,29.32 19.48,29.32 19.48,31.86 14.8,31.86 14.8,32.97 14.01,32.97 13.93,33.05 13.13,33.05
  pour Bottom: 15.35,33.13 15.35,31.86 17.42,31.86 17.42,25.91 20.43,25.91 21.07,25.27 21.07,24.08 20.99,24 20.12,24 19.56,24.56 15.2,24.56 12.34,21.7 11.31,21.7 9.8,20.19 8.45,20.19 8.45,26.86 14.72,33.13
  pour Bottom: 29.01,16.86 29.01,19.72 30.04,20.75 32.58,20.75 33.69,19.64 33.69,18.29 32.98,18.29 31.94,19.32 31.39,19.32 31.31,19.24 31.31,17.02 31.07,16.78 29.09,16.78
  pour Bottom (no thermals): 41.47,27.42 41.47,15.75 37.98,12.26 34.48,12.26 34.48,16.07 35.44,17.02 35.44,17.41 35.83,17.81 35.83,23.37 38.06,23.37 38.61,23.92 38.61,27.42
  pour Top (no thermals): 36.31,34.64 36.31,34.48 36.07,34.24 36.07,33.85 34.32,33.85 34.32,35.2 34.88,34.64
GVDD
  Top 0.3: U1.GVDD U1.MODE
  Top 0.7: JP2.2 9.71,47.76
  pour Top (no thermals): 20.2,24.96 20.83,24.96 20.83,28.92 7.34,28.92 7.34,26.07 20.2,26.07
  pour Top (no thermals): 9.4,48.45 10.04,48.45 10.04,46.86 10.35,46.55 10.35,43.61 9.33,43.61 9.33,25.99 6.7,25.99 6.31,26.38 6.31,44.48 7.18,45.35 8.61,45.35 9.4,46.15
  pour Top: 10.35,45.67 10.35,43.29 8.77,41.7 8.61,41.7 8.61,44.72 9.56,45.67
GVDD_IN
  Top 0.7: X2.1 13.56,47.54 11.04,47.54 JP2.1
  pour Top (no thermals): 10.43,47.97 15.04,47.97 15.51,47.5 15.51,45.12 14.96,44.56 13.53,44.56 12.18,45.91 12.18,46.78 12.02,46.94 10.43,46.94
HA  (1 unrouted)
  Top 0.3: Q2.1 14.61,13.27
HB
  Top 0.5: Q3.1 23.97,13.27 R3.2
HC
  Top 0.5: Q4.1 33.26,13.27 R5.2
INA  (via drill 0.35)
  Top 0.3: v22.34,27.02 22.24,26.92 22.24,26.5 | 22.24,26.5 U1.INLA | v26.31,24.72 25.94,24.35 | 25.94,24.35 25.37,23.78 U1.INHA | NUCLEO_MAIN.PC7 23.91,34.06 23.12,33.27 | 23.19,33.42 v22.66,32.89 | v21.07,30.11 21.07,30.04 21.4,29.71 | 21.4,29.71 22.37,28.73 | 22.37,28.73 v22.74,28.36 | 25.94,24.35 26.38,24.56 v26.31,24.72 | 25.94,24.35 26.15,24.79 v26.31,24.72 | 22.24,26.5 22.49,26.93 v22.34,27.02 | 22.24,26.5 22.16,26.99 v22.34,27.02 | 23.19,33.42 22.74,33.21 22.61,33.15 22.66,33.06 v22.66,32.89 | 23.19,33.42 23.12,33.27 | 23.12,33.27 22.85,32.7 v22.66,32.89 | 21.4,29.71 21.24,30.17 v21.07,30.11 | 21.4,29.71 20.98,29.96 v21.07,30.11 | 22.37,28.73 22.58,28.28 v22.74,28.36 | 22.37,28.73 22.82,28.52 v22.74,28.36
  Bottom 0.3: v22.35,27.01 v22.34,27.02 | v21.07,30.11 21.09,30.11 21.09,30.64 | 21.09,30.64 21.09,31.13 21.71,31.87 22.66,32.81 v22.66,32.89 | v22.74,28.36 22.37,27.99 | 22.37,27.99 22.35,27.96 22.35,27.54 | 22.35,27.54 v22.35,27.01 | v22.35,27.01 22.35,26.77 22.57,26.55 | 25.84,24.48 24.96,24.48 23.93,25.51 23.61,25.51 22.57,26.55 | 25.84,24.48 26.07,24.48 v26.31,24.72 | 25.84,24.48 26.33,24.54 v26.31,24.72 | 25.84,24.48 26.18,24.84 v26.31,24.72 | 22.35,27.54 22.17,27.08 v22.34,27.02 | 22.35,27.54 22.51,27.08 v22.34,27.02 | 22.57,26.55 22.52,27.04 v22.34,27.02 | 22.57,26.55 22.22,26.89 v22.34,27.02 | 21.09,30.64 20.9,30.18 v21.07,30.11 | 21.09,30.64 21.24,30.17 v21.07,30.11 | 22.37,27.99 22.82,28.2 v22.74,28.36 | 22.37,27.99 22.58,28.44 v22.74,28.36
INB  (via drill 0.35)
  Top 0.3: U1.INHB 22.94,24.26 23.38,24.26 23.69,24.57 23.69,24.81 | 23.69,24.81 23.69,25.62 23.13,26.18 23.13,27.44 22.92,27.65 22.08,27.65 21.71,27.28 21.71,25.49 U1.INLB | 23.69,24.81 25.09,24.81 | 25.09,24.81 25.51,24.81 v25.51,25.11 | NUCLEO_MAIN.PB4 30.93,26.88 30.93,25.88 30.07,25.02 | 30.07,25.02 29.93,24.88 v29.56,24.88 | 25.09,24.81 25.56,24.94 v25.51,25.11 | 25.09,24.81 25.37,25.21 v25.51,25.11 | 30.07,25.02 29.58,25.05 v29.56,24.88 | 30.07,25.02 29.66,24.73 v29.56,24.88
  Bottom 0.3: v29.56,24.88 29.19,25.25 | 29.19,25.25 29.01,25.43 25.93,25.43 | 25.93,25.43 25.83,25.43 v25.51,25.11 | 25.93,25.43 25.46,25.28 v25.51,25.11 | 25.93,25.43 25.66,25.02 v25.51,25.11 | 29.19,25.25 29.4,24.8 v29.56,24.88 | 29.19,25.25 29.64,25.04 v29.56,24.88
INC  (via drill 0.35)  (1 unrouted)
  Top 0.3: U1.INHC 22.85,24.85 v22.85,25.25 | v21.21,27.75 21.26,27.71 21.26,27.23 | 21.26,27.23 21.26,25.48 U1.INLC | v21.21,27.75 20.84,28.12 | 20.84,28.12 20.02,28.94 20.02,29.59 | v19.96,30.11 20.02,30.05 20.02,29.59 | NUCLEO_MAIN.PB10 28.9,35.72 27.16,33.98 | 27.16,33.98 v26.78,33.61 | 21.23,27.29 21.34,27.72 v21.21,27.75 | 21.26,27.23 21.23,27.29 | 21.23,27.29 21.05,27.68 v21.21,27.75 | 20.84,28.12 21.05,27.68 v21.21,27.75 | 20.84,28.12 21.29,27.91 v21.21,27.75 | 20.02,29.59 20.13,30.07 v19.96,30.11 | 20.02,29.59 19.8,30.04 v19.96,30.11 | 27.16,33.98 26.71,33.77 v26.78,33.61 | 27.16,33.98 26.95,33.53 v26.78,33.61
  Bottom 0.3: v22.85,25.25 22.85,25.56 22.68,25.74 | 22.68,25.74 21.21,27.21 21.21,27.23 | 21.21,27.23 v21.21,27.75 | v19.96,30.11 19.96,30.64 | 19.96,30.64 19.96,31.23 22.26,33.53 26.47,33.53 | 22.68,25.74 22.68,25.25 v22.85,25.25 | 22.68,25.74 22.99,25.36 v22.85,25.25 | 21.21,27.23 21.38,27.69 v21.21,27.75 | 21.21,27.23 21.04,27.69 v21.21,27.75 | 19.96,30.64 19.79,30.18 v19.96,30.11 | 19.96,30.64 20.12,30.18 v19.96,30.11 | v26.78,33.61 26.65,33.73
L
  Top 0.5: R20.1 D3.A
LA
  Top 0.5: Q2.8 8.24,13.27 R2.2
LB
  Top 0.3: R4.2 18.73,13.07 18.85,13.19 19.27,13.19 Q3.8
LC
  Top 0.5: Q4.8 26.18,13.27 R6.2
LED  (via drill 0.35)
  Top 0.3: v35.52,30.02 35.55,29.98 35.64,30.06 36.04,30.06 | 36.04,30.06 NUCLEO_MAIN.PC14 | 36.04,30.06 35.56,30.19 v35.52,30.02 | 36.04,30.06 35.59,29.86 v35.52,30.02 | R23.2 39.96,20.61 39.96,21.91 37.78,24.09 v37.78,24.25
  Bottom 0.3: 35.84,29.61 37.58,27.87 37.58,24.25 v37.78,24.25 | 35.84,29.61 35.52,29.94 v35.52,30.02 | 35.84,29.61 35.68,30.07 v35.52,30.02 | 35.84,29.61 35.42,29.86 v35.52,30.02
MISO  (via drill 0.35)
  Top 0.3: v28.53,32.89 28.9,33.26 | 28.9,33.26 30.16,34.52 30.16,35.71 30.99,36.54 31.55,36.54 32.42,37.42 32.42,38.69 NUCLEO_MAIN.PA6 | 28.9,33.26 28.45,33.05 v28.53,32.89 | 28.9,33.26 28.69,32.82 v28.53,32.89
  Bottom 0.3: U2.3 18.23,27.65 19.16,27.65 20.43,28.92 21.7,28.92 22.26,29.48 22.26,30.83 23.69,32.26 27.9,32.26 28.16,32.52 | v28.53,32.89 28.16,32.52 | 28.16,32.52 28.61,32.73 v28.53,32.89 | 28.16,32.52 28.37,32.97 v28.53,32.89
MOSI  (via drill 0.35)
  Top 0.3: NUCLEO_MAIN.PA7 31.9,37.7 31.35,37.14 30.64,37.14 29.6,36.1 29.6,35.16 28.15,33.7 | 28.15,33.7 27.82,33.38 v27.74,33.38 | 28.15,33.7 27.68,33.54 v27.74,33.38 | 28.15,33.7 27.89,33.28 v27.74,33.38
  Bottom 0.3: 27.37,33 27.18,32.82 23.54,32.82 21.7,30.99 21.7,29.64 21.51,29.44 20.24,29.44 19.16,28.37 U2.4 | 27.37,33 v27.74,33.38 | 27.37,33 27.81,33.21 v27.74,33.38 | 27.37,33 27.58,33.45 v27.74,33.38
N$8  (via drill 0.3)
  Top 0.3: R11.1 27.68,18.31 28.24,18.87 | 28.24,18.87 28.29,18.92 v28.29,19.32 | 28.24,18.87 28.43,19.25 v28.29,19.32 | 28.24,18.87 28.14,19.29 v28.29,19.32
  Bottom 0.3: U4.5 24.37,8.46 25.12,7.71 R8.2 25.83,7.55 28.13,7.55 28.91,8.33 30.63,8.33 33.21,10.91 33.21,16.54 34.17,17.49 34.17,20.19 32.9,21.46 29.72,21.46 28.68,20.42 28.35,19.77 | v28.29,19.32 28.29,19.72 28.35,19.77 | 28.35,19.77 28.15,19.39 v28.29,19.32 | 28.35,19.77 28.44,19.35 v28.29,19.32
N$9
  Bottom 0.3: R12.1 22.42,10.03 22.42,8.29 23.05,7.65 U4.6
  Bottom 1: R12.1 R9.2
N$10  (via drill 0.35)
  Top 0.3: v11.16,7.01 10.63,7.01 | 10.63,7.01 8.61,7.01 7.85,7.77 7.85,11.11 7.18,11.78 7.18,13.45 7.02,13.61 7.02,18.05 9.8,20.83 10.91,20.83 11.39,20.35 11.39,19.69 9.19,17.49 R14.1 | 10.63,7.01 11.1,6.84 v11.16,7.01 | 10.63,7.01 11.1,7.17 v11.16,7.01
  Bottom 0.3: U4.3 16.36,7.65 R16.2 15.99,7.39 11.54,7.39 11.53,7.38 | 11.53,7.38 v11.16,7.01 | 11.53,7.38 11.08,7.17 v11.16,7.01 | 11.53,7.38 11.32,6.93 v11.16,7.01
N$11
  Bottom 0.3: U4.2 19.33,6.86 20.19,6 20.19,4.44 R17.2
  Bottom 1: R15.1 R17.2
N$14  (via drill 0.35)
  Top 0.3: R19.1 11.41,44.25 11.31,44.48 v11.31,44.9
  Bottom 0.7: v11.31,44.9 D1.A
N$15  (via drill 0.35)
  Bottom 0.7: D2.A 8.94,47.02 R27.1
  other vias: 8,46.07
N$21
  Top 0.3: R23.1 D6.A
NRST
  Top 0.3: U$2.5 39.91,34.57 39.85,34.5 38.93,33.58 R21.2 37.06,32.08 NUCLEO_MAIN.NRST
  Top 0.6: 39.85,34.5 40.46,34.2 U$2.5 40.4,34.9 39.85,34.5
PVDD  (via drill 0.35)
  Top 0.3: 17.18,46.39 X2.2
  Top 0.5: R19.2 11.41,45.97 13.37,44.01 15.51,44.01 17.18,45.67 17.18,46.39
  Top 0.7: JP2.3 8.69,49.01 8.7,49 11.25,49 11.69,48.55 15.65,48.55
  Top 1: Q2.3 12.94,14.24 Q2.10 | Q3.3 22.56,14.64 v22.34,14.64
  Bottom 0.3: C21.2 1.4,21 1.7,21 | C5.2 13.4,14 v13.61,14 | C20.2 1.4,24 1.7,24 | C19.2 1.4,27.25 1.7,27.25 | C17.2 1.4,30.25 1.7,30.25 | C13.2 1.4,33.25 1.7,33.25 | C22.2 1.4,36.5 1.7,36.5 | v22.34,14 23.83,15.48 23.36,15.14 | 23.36,15.14 22.84,14.79 | 22.84,14.79 C2.2 | v22.34,14 22.26,14.16 22.71,14.37 22.5,13.93 v22.34,14 | 22.84,14.79 22.35,14.81 v22.34,14.64 22.44,14.49 22.84,14.79 | v13.61,14 13.43,13.98 13.39,14.48 13.73,14.13 v13.61,14 | 23.36,15.14 22.95,14.86 v23.05,14.72 23.22,14.67 23.36,15.14 | 13.39,14.45 13.79,14.73 v13.69,14.88 13.52,14.92 13.39,14.45 | 13.47,14 13.3,14.46 v13.13,14.4 13.04,14.24 13.47,14
  Bottom 1: C5.2 13.3,14.64 13.3,11.93 13.53,11.7 | C2.2 22.74,11.71 22.74,11.7 | C6.2 32.03,12.66 31.07,11.7
  Bottom 1.5: X2.2 17.18,45.35 14.16,42.34 3.92,42.34 1.7,40.12 1.7,36.5 1.7,33.25 1.7,30.25 1.7,27.25 1.7,24 1.7,21 1.7,19.94 9.94,11.7 13.53,11.7 22.74,11.7 31.07,11.7
  other vias: 32.34,15.51 32.34,14.72 31.63,14.64 32.34,14 22.34,15.35 23.05,14 13.29,15.43 31.63,14 30.83,15.35 30.83,13.92 30.83,14.64 21.55,14.64 21.55,15.35 21.55,13.92 21.55,13.21 12.26,15.43 12.74,14.88 12.26,14.4 12.74,13.92 12.81,15.83 12.26,13.29 22.02,15.91 30.83,13.21 31.63,15.35 31.23,15.91 31.86,15.91 23.05,15.35 22.74,15.91
  pour Top (no thermals): 11.86,16.78 14.01,16.78 14.01,13.68 11.86,13.68
  pour Top (no thermals): 21.23,16.22 23.37,16.22 23.37,13.68 21.23,13.68
  pour Top (no thermals): 30.51,16.62 32.66,16.62 32.66,13.68 30.51,13.68
  pour Top (no thermals): 9.08,47.26 9.08,48.77 14.64,48.77 16.23,47.18 16.23,44.96 16.62,44.56 17.1,44.56 18.13,45.59 18.13,49.8 6.54,49.8 6.23,49.48 6.23,47.9 6.86,47.26
  pour Bottom (no thermals): 15.75,48.13 18.37,48.13 18.37,44.09 13.21,38.93 5.67,38.93 3.92,37.18 3.92,19.16 12.42,10.67 12.42,8.84 8.61,8.84 -0.44,17.89 -0.44,42.74 1.31,44.48 14.96,44.48 15.75,45.28
  pour Bottom (no thermals): 11.86,16.3 16.15,16.3 16.15,11.86 11.86,11.86
  pour Bottom (no thermals): 21.15,12.26 21.15,16.3 25.12,16.3 25.12,12.18 21.23,12.18
  pour Bottom (no thermals): 29.72,16.46 32.66,16.46 32.66,11.94 31.71,10.99 29.72,10.99
  pour Bottom (no thermals): 6.54,12.41 6.54,9.64 8.45,7.73 15.83,7.73 18.85,10.75 23.69,10.75 25.59,8.84 30.51,8.84 32.66,10.99 32.66,12.41
  pour Bottom (no thermals): 16.07,12.26 16.07,13.37 21.7,13.37 21.7,12.26
SW  (via drill 0.35)  (1 unrouted)
  Top 0.3: NUCLEO_MAIN.PC13 37,29.52 36.17,29.52 35.92,29.26 | 35.92,29.26 35.59,28.94 v35.59,28.84 | 35.92,29.26 35.5,29 v35.59,28.84 | 35.92,29.26 35.76,28.79 v35.59,28.84
  Bottom 0.3: v35.59,28.84 35.97,28.47 | 35.97,28.47 36.82,27.62 36.82,24.54 | 36.82,24.54 v36.82,24.01 | 35.97,28.47 35.75,28.92 v35.59,28.84 | 35.97,28.47 35.52,28.68 v35.59,28.84 | 36.82,24.54 36.66,24.07 v36.82,24.01 | 36.82,24.54 36.99,24.07 v36.82,24.01
SWCLK  (via drill 0.35)
  Top 0.3: NUCLEO_MAIN.PA14 27.38,26.93 | 27.38,26.93 27.29,27.02 v26.86,27.02 | 27.38,26.93 26.95,27.17 v26.86,27.02 | 27.38,26.93 26.89,26.84 v26.86,27.02
  Bottom 0.3: U$2.3 39.96,30.57 39.85,30.68 38.66,31.86 32.02,31.86 31.27,31.11 31.27,29.68 28.79,27.2 27.36,27.2 | 27.36,27.2 27.18,27.02 v26.86,27.02 | 27.36,27.2 26.86,27.2 v26.86,27.02 | 27.36,27.2 26.98,26.88 v26.86,27.02
  Bottom 0.6: 39.85,30.68 40.38,30.25 U$2.3 40.48,30.94 39.85,30.68
SWDIO  (via drill 0.35)
  Top 0.3: v26.63,30.04 26.55,30.04 | 26.55,30.04 26.54,30.03 26.02,30.03 | 26.02,30.03 25.28,30.03 NUCLEO_MAIN.PA13 | 26.02,30.03 26.49,29.87 26.55,30.04 | 26.02,30.03 26.48,30.2 26.55,30.04
  Bottom 0.3: v26.63,30.04 26.63,29.64 27.58,28.69 29.4,28.69 30.58,29.86 30.58,31.29 31.85,32.57 39.84,32.57 U$2.4
  Bottom 0.6: 39.84,32.57 40.43,32.21 U$2.4 40.43,32.92 39.84,32.57
U  (via drill 0.3, 0.35)  (1 unrouted)
  Top 0.3: U1.SHA 22.92,21.59 23.37,21.15 23.37,20.25 23.22,20.11 22.6,20.11 | 22.6,20.11 22.16,20.11 v22.08,20.19 | R14.2 10.73,18.03 13.17,20.47 13.73,20.47 v13.77,20.43 | 22.54,20.1 22.15,20.31 v22.08,20.19 | 22.6,20.11 22.54,20.1 | 22.54,20.1 22.12,20.01 v22.08,20.19
  Top 1: 12.1,17.49 C1.2 | R14.2 11.07,17.16 Q2.9 11.07,11.14 10.03,10.11 R13.2
  Bottom 0.3: v22.08,20.19 21.71,19.82 | 21.71,19.82 21.53,19.64 15.75,19.64 14.96,20.43 v13.77,20.43 | 21.71,19.82 22.16,20.03 v22.08,20.19 | 21.71,19.82 21.92,20.26 v22.08,20.19
U_CS
  Top 0.5: ..7 21.31,8.01 ..6
  Top 1: JP3.1 18.45,3.29 21.31,6.14 21.31,8.01 21.31,9.24 20.51,10.03 14.33,10.03 R13.1
  Bottom 0.3: R15.2 16.47,4.34 16.47,3.6 17.34,2.73 17.43,2.73 JP3.1
  Bottom 0.6: 17.43,2.73 18.16,2.27 JP3.1 18.16,3.19 17.43,2.73
USBRX  (via drill 0.35)
  Top 0.3: NUCLEO_MAIN.PA3 35.01,38.61 35.63,38.61 | v36.15,38.61 35.63,38.61 | 35.63,38.61 36.09,38.44 v36.15,38.61 | 35.63,38.61 36.09,38.77 v36.15,38.61
  Bottom 0.3: U$2.7 39.84,38.57 36.67,38.57 | 36.67,38.57 36.19,38.57 v36.15,38.61 | 36.67,38.57 36.22,38.77 v36.15,38.61 | 36.67,38.57 36.2,38.44 v36.15,38.61
  Bottom 0.6: 39.84,38.57 40.43,38.21 U$2.7 40.43,38.92 39.84,38.57
USBTX
  Top 0.3: NUCLEO_MAIN.PA2 39.84,36.56 U$2.6
  Top 0.6: 39.84,36.56 40.43,36.21 U$2.6 40.43,36.92 39.84,36.56
V  (via drill 0.35)
  Top 0.3: U1.SHB 20.74,20.68 20.7,20.64 | 20.7,20.64 v20.33,20.27 | v16.86,20.35 16.86,19.83 | 16.86,19.83 16.86,18.75 18.67,16.94 C3.2 | 20.7,20.64 20.26,20.43 v20.33,20.27 | 20.7,20.64 20.49,20.19 v20.33,20.27 | 16.86,19.83 17.03,20.29 v16.86,20.35 | 16.86,19.83 16.7,20.29 v16.86,20.35
  Top 0.5: ..9 23.53,8.01 ..8
  Top 1: C3.2 20.38,16.7 20.38,14.29 Q3.9 20.43,12.26 23.53,9.16 23.53,8.01 23.53,5.67 20.99,3.13 JP3.2
  Bottom 0.3: v20.33,20.27 20.25,20.35 19.81,20.35 | 19.81,20.35 17.39,20.35 | 17.39,20.35 v16.86,20.35 | 19.81,20.35 20.25,20.11 v20.33,20.27 | 19.81,20.35 20.3,20.44 v20.33,20.27 | 17.39,20.35 16.92,20.52 v16.86,20.35 | 17.39,20.35 16.92,20.18 v16.86,20.35
VCAP
  Top 0.3: NUCLEO_MAIN.VCAP_1 28.4,36.31 28.08,35.99 27.26,35.99 25.05,38.2 C14.1
VDDA
  Top 0.3: BEAD.1 37.49,38.04 37.09,37.64 36.06,37.64 35.04,36.62 35.04,35.35 35.33,35.06 NUCLEO_MAIN.VREF+
  pour Top (no thermals): 37.82,38.85 38.61,38.85 38.61,37.02 36.23,37.02 36.15,36.94 36.15,34.96 34.96,34.96 34.56,35.35 34.56,37.1 35.59,38.13 36.47,38.13 36.71,38.37
W
  Top 0.3: U1.SHC 18.21,21.43 18.21,18.92 18.85,18.29 23.53,18.29 26.15,20.91 27.58,20.91 29.38,19.11 R11.2
  Top 1: C7.2 R11.2 29.72,17.08 Q4.9 29.74,14.22 29.74,12.57 31.95,10.36 R10.2
W_CS  (via drill 0.35)
  Top 0.5: ..10 25.12,8.01 25.75,8.01 ..11
  Top 1: 25.75,8.01 25.43,7.69 25.43,5.11 23.53,3.21 JP3.3 | 25.12,8.01 26.27,9.16 26.55,9.16 v27.42,8.29 28.29,9.16 R10.1
  Bottom 0.3: R12.2 23.85,10.03 25.28,8.6 26.32,8.6 26.95,8.53 | 26.95,8.53 27.18,8.53 v27.42,8.29 | 26.95,8.53 27.29,8.16 v27.42,8.29 | 26.95,8.53 27.44,8.46 v27.42,8.29

## Text on the board
tPlace: GVDD | VIN | GND | +5V | CANH | CANL | MD ID | Designed by | Daiki Tomioka | F446RE | Version 1.0
bPlace: GND | RX | TX | RST | SWDIO | SWCLK | 3V3 | GND | + | -